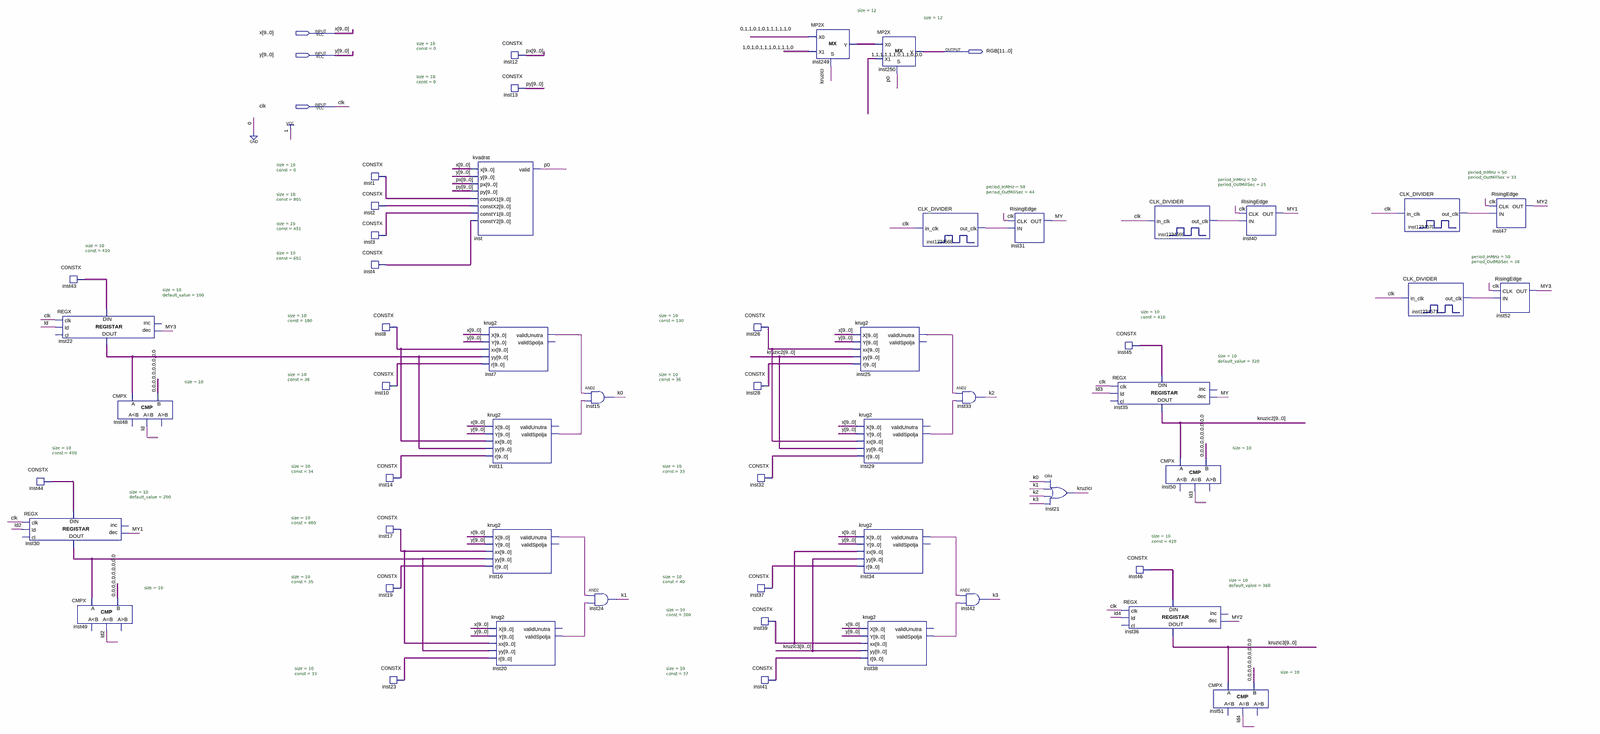
[diagram p0: schematic sheet, whole]
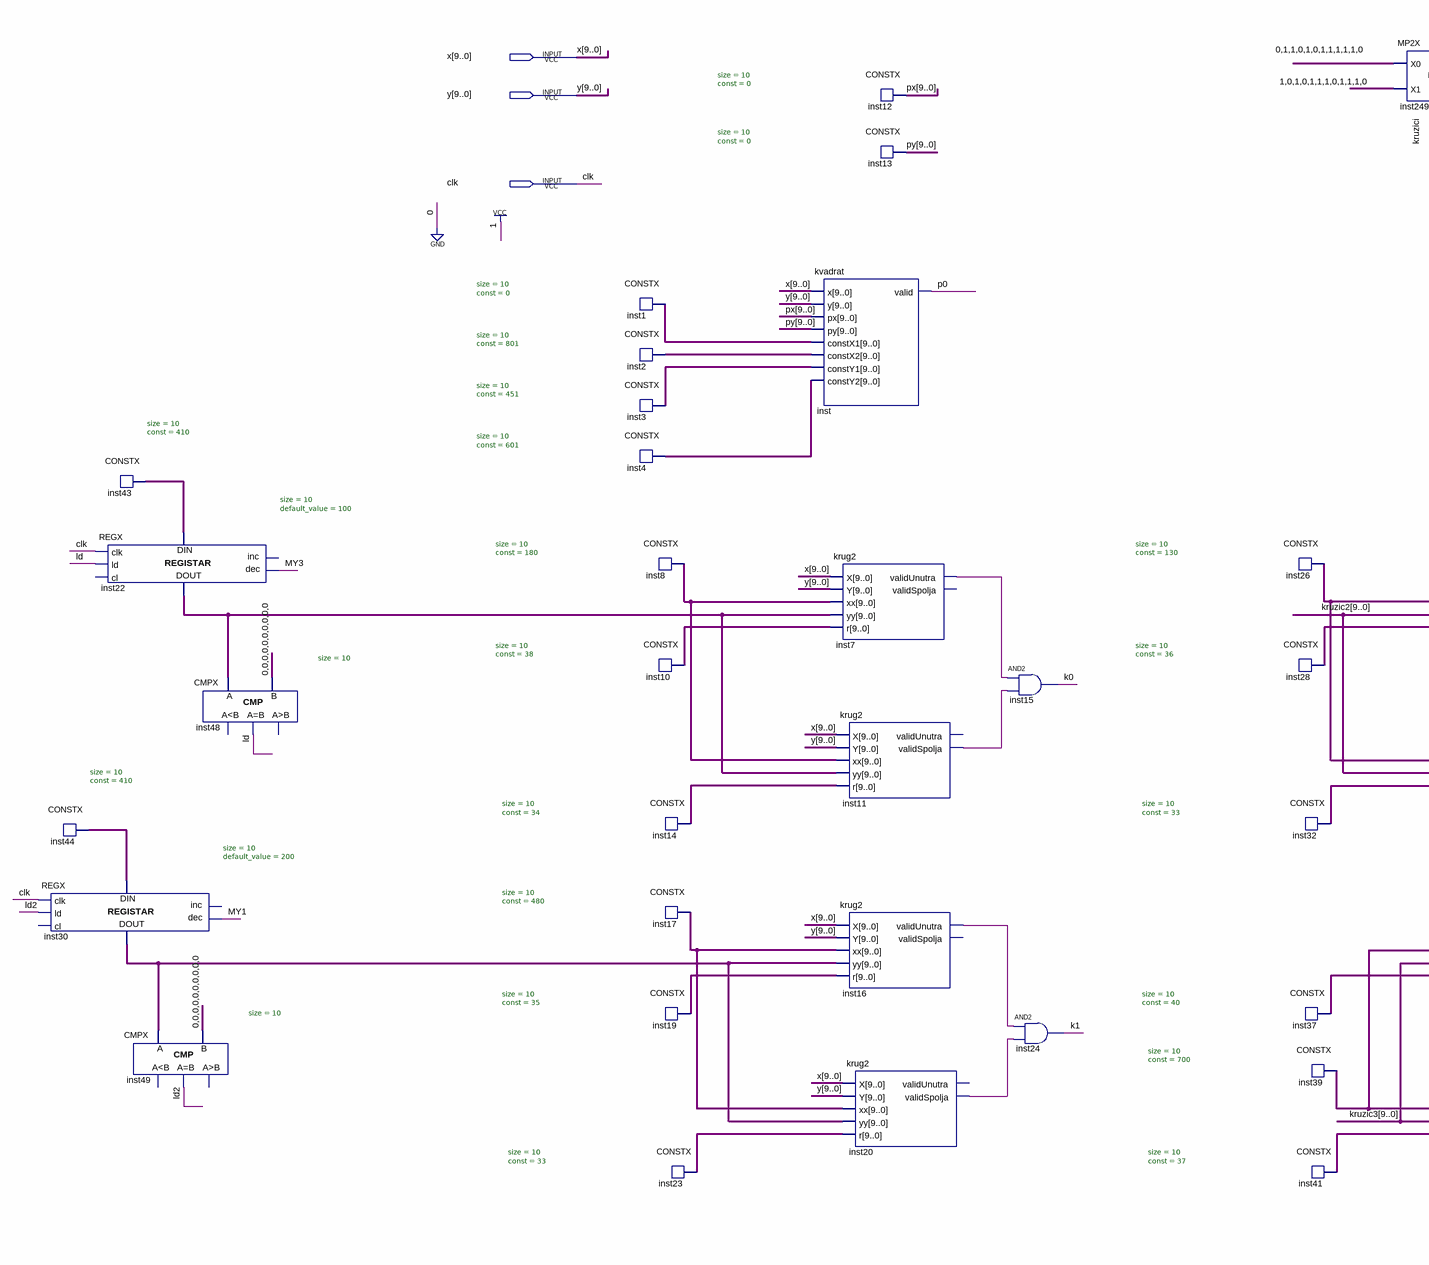
[diagram p1: schematic sheet, left part]
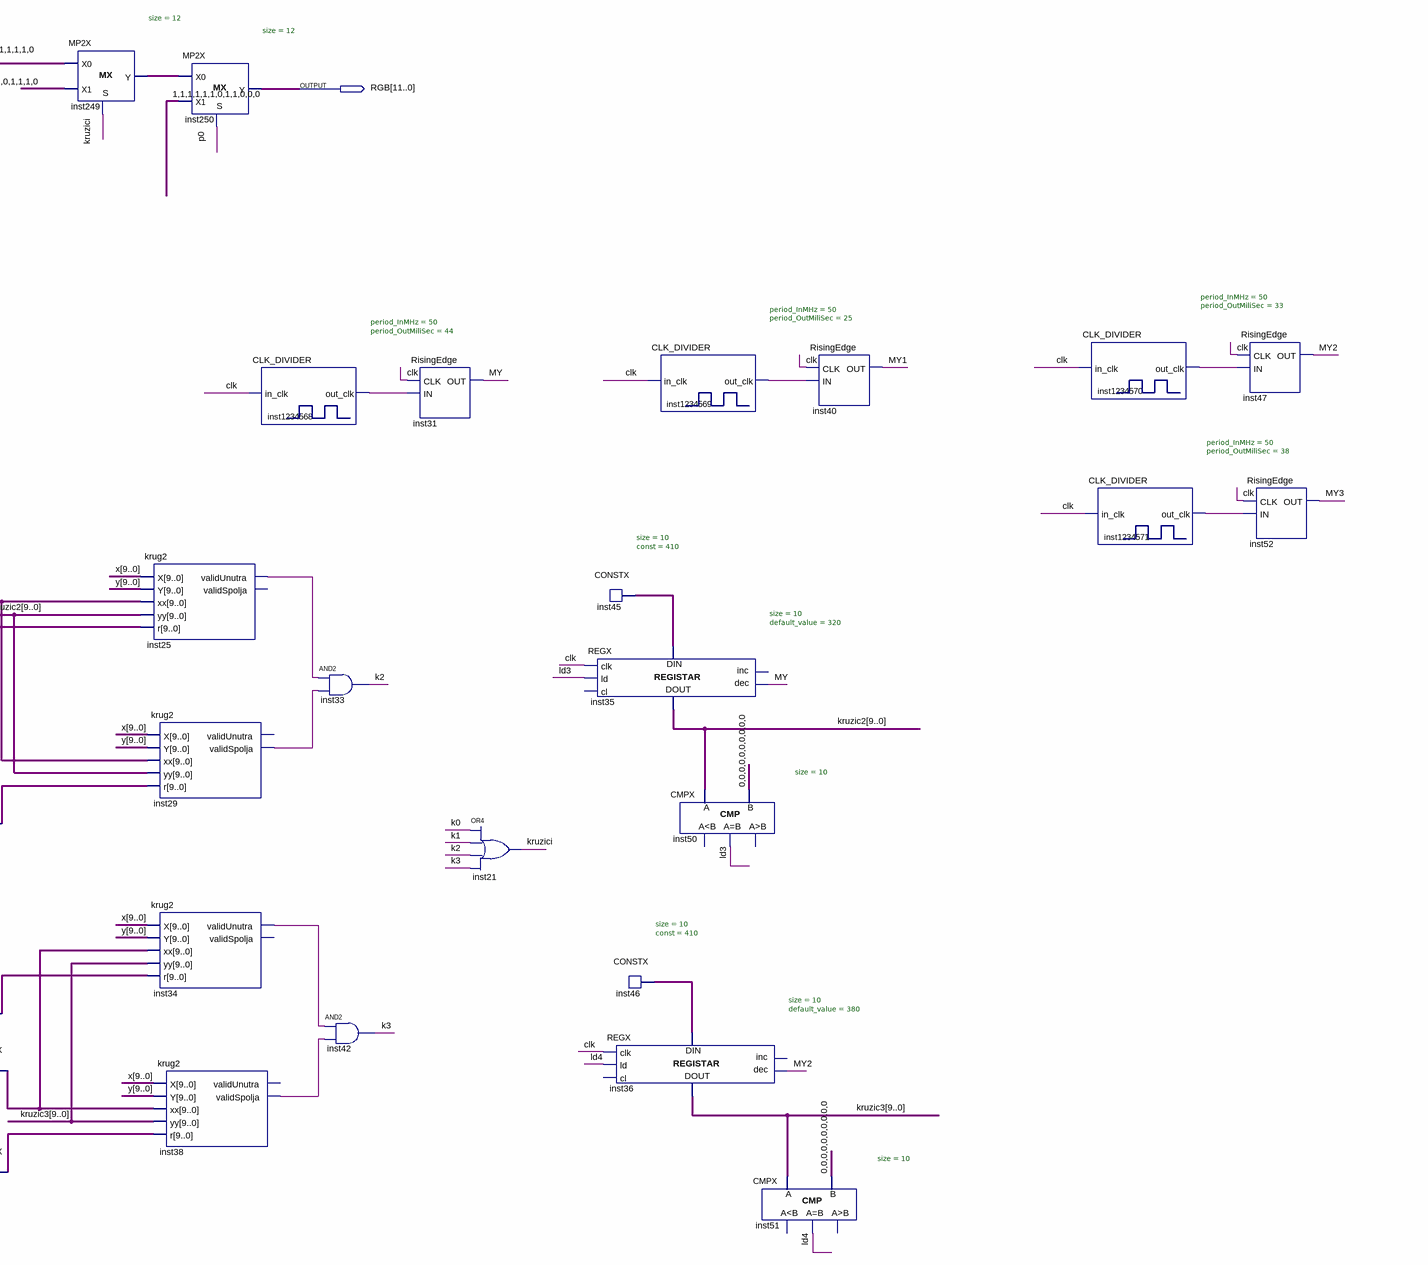
[diagram p2: schematic sheet, right part]
// Quartus schematic pozadina.bdf as structural Verilog: 54 symbols, 4 pins
module pozadina (
  input  [9:0] x,
  input  [9:0] y,
  input  clk,
  output [11:0] RGB
);

  wire inst7_validunutra, inst11_validspolja, inst16_validunutra, inst20_validspolja, inst25_validunutra,
       inst29_validspolja, inst34_validunutra, inst38_validspolja, inst1234568_out_clk, inst1234569_out_clk,
       inst1234570_out_clk, inst1234571_out_clk, k0, k1, k2, k3, kruzici, ld, ld2, ld3, ld4, MY, MY1, MY2,
       MY3, p0;
  wire [9:0] inst1_data, inst2_data, inst3_data, inst4_data, inst8_data, inst10_data, inst14_data,
       inst17_data, inst19_data, inst22_data_out, inst23_data, inst26_data, inst28_data, inst30_data_out,
       inst32_data, inst37_data, inst39_data, inst41_data, inst43_data, inst44_data, inst45_data,
       inst46_data, kruzic2, kruzic3, px, py;
  wire [11:0] inst249_y;

  CONSTX #(.size(10), .\const (410)) inst44 (.data(inst44_data));
  REGX #(.size(10), .default_value(200)) inst30 (
    .clk(clk), .ld(ld2), .dec(MY1), .data_in(inst44_data), .data_out(inst30_data_out));  // open: cl, inc
  CONSTX #(.size(10), .\const (410)) inst43 (.data(inst43_data));
  REGX #(.size(10), .default_value(100)) inst22 (
    .clk(clk), .ld(ld), .dec(MY3), .data_in(inst43_data), .data_out(inst22_data_out));  // open: cl, inc
  CMPX #(.size(10)) inst49 (.A(inst30_data_out), .B({10{1'b0}}), .eq(ld2));  // open: ls, gr
  CMPX #(.size(10)) inst48 (.A(inst22_data_out), .B({10{1'b0}}), .eq(ld));  // open: ls, gr
  CONSTX #(.size(10), .\const (0)) inst1 (.data(inst1_data));
  CONSTX #(.size(10), .\const (801)) inst2 (.data(inst2_data));
  CONSTX #(.size(10), .\const (451)) inst3 (.data(inst3_data));
  CONSTX #(.size(10), .\const (601)) inst4 (.data(inst4_data));
  CONSTX #(.size(10), .\const (180)) inst8 (.data(inst8_data));
  CONSTX #(.size(10), .\const (38)) inst10 (.data(inst10_data));
  CONSTX #(.size(10), .\const (34)) inst14 (.data(inst14_data));
  CONSTX #(.size(10), .\const (480)) inst17 (.data(inst17_data));
  CONSTX #(.size(10), .\const (35)) inst19 (.data(inst19_data));
  CONSTX #(.size(10), .\const (33)) inst23 (.data(inst23_data));
  kvadrat inst (
    .x(x), .y(y), .px(px), .py(py), .constX1(inst1_data), .constX2(inst2_data), .constY1(inst3_data),
    .constY2(inst4_data), .valid(p0));
  CONSTX #(.size(10), .\const (0)) inst12 (.data(px));
  CONSTX #(.size(10), .\const (0)) inst13 (.data(py));
  krug2 inst7 (
    .X(x), .Y(y), .xx(inst8_data), .yy(inst22_data_out), .r(inst10_data), .validUnutra(inst7_validunutra));  // open: validSpolja
  krug2 inst11 (
    .X(x), .Y(y), .xx(inst8_data), .yy(inst22_data_out), .r(inst14_data), .validSpolja(inst11_validspolja));  // open: validUnutra
  krug2 inst16 (
    .X(x), .Y(y), .xx(inst17_data), .yy(inst30_data_out), .r(inst19_data), .validUnutra(inst16_validunutra));  // open: validSpolja
  krug2 inst20 (
    .X(x), .Y(y), .xx(inst17_data), .yy(inst30_data_out), .r(inst23_data), .validSpolja(inst20_validspolja));  // open: validUnutra
  and inst15 (k0, inst7_validunutra, inst11_validspolja);
  and inst24 (k1, inst16_validunutra, inst20_validspolja);
  CONSTX #(.size(10), .\const (130)) inst26 (.data(inst26_data));
  CONSTX #(.size(10), .\const (36)) inst28 (.data(inst28_data));
  CONSTX #(.size(10), .\const (33)) inst32 (.data(inst32_data));
  CONSTX #(.size(10), .\const (40)) inst37 (.data(inst37_data));
  CONSTX #(.size(10), .\const (700)) inst39 (.data(inst39_data));
  CONSTX #(.size(10), .\const (37)) inst41 (.data(inst41_data));
  MP2X #(.size(12)) inst249 (.S(kruzici), .X0(12'b011010111110), .X1(12'b101011101110), .Y(inst249_y));
  krug2 inst25 (
    .X(x), .Y(y), .xx(inst26_data), .yy(kruzic2), .r(inst28_data), .validUnutra(inst25_validunutra));  // open: validSpolja
  krug2 inst29 (
    .X(x), .Y(y), .xx(inst26_data), .yy(kruzic2), .r(inst32_data), .validSpolja(inst29_validspolja));  // open: validUnutra
  krug2 inst34 (
    .X(x), .Y(y), .xx(inst39_data), .yy(kruzic3), .r(inst37_data), .validUnutra(inst34_validunutra));  // open: validSpolja
  MP2X #(.size(12)) inst250 (.S(p0), .X0(inst249_y), .X1(12'b111111011000), .Y(RGB));
  krug2 inst38 (
    .X(x), .Y(y), .xx(inst39_data), .yy(kruzic3), .r(inst41_data), .validSpolja(inst38_validspolja));  // open: validUnutra
  CLK_DIVIDER #(.period_InMHz(50), .period_OutMiliSec(44)) inst1234568 (.in_clk(clk), .out_clk(inst1234568_out_clk));
  and inst33 (k2, inst25_validunutra, inst29_validspolja);
  and inst42 (k3, inst34_validunutra, inst38_validspolja);
  RisingEdge inst31 (.CLK(clk), .IN(inst1234568_out_clk), .OUT(MY));
  or inst21 (kruzici, k0, k1, k2, k3);
  CONSTX #(.size(10), .\const (410)) inst45 (.data(inst45_data));
  REGX #(.size(10), .default_value(320)) inst35 (
    .clk(clk), .ld(ld3), .dec(MY), .data_in(inst45_data), .data_out(kruzic2));  // open: cl, inc
  REGX #(.size(10), .default_value(380)) inst36 (
    .clk(clk), .ld(ld4), .dec(MY2), .data_in(inst46_data), .data_out(kruzic3));  // open: cl, inc
  CLK_DIVIDER #(.period_InMHz(50), .period_OutMiliSec(25)) inst1234569 (.in_clk(clk), .out_clk(inst1234569_out_clk));
  CONSTX #(.size(10), .\const (410)) inst46 (.data(inst46_data));
  CMPX #(.size(10)) inst50 (.A(kruzic2), .B({10{1'b0}}), .eq(ld3));  // open: ls, gr
  CMPX #(.size(10)) inst51 (.A(kruzic3), .B({10{1'b0}}), .eq(ld4));  // open: ls, gr
  RisingEdge inst40 (.CLK(clk), .IN(inst1234569_out_clk), .OUT(MY1));
  CLK_DIVIDER #(.period_InMHz(50), .period_OutMiliSec(33)) inst1234570 (.in_clk(clk), .out_clk(inst1234570_out_clk));
  CLK_DIVIDER #(.period_InMHz(50), .period_OutMiliSec(38)) inst1234571 (.in_clk(clk), .out_clk(inst1234571_out_clk));
  RisingEdge inst47 (.CLK(clk), .IN(inst1234570_out_clk), .OUT(MY2));
  RisingEdge inst52 (.CLK(clk), .IN(inst1234571_out_clk), .OUT(MY3));
endmodule
